# Altium schematic sheet STM32L412CBT6.SchDoc
size A3; SheetNumber: 6; SheetTotal: 9
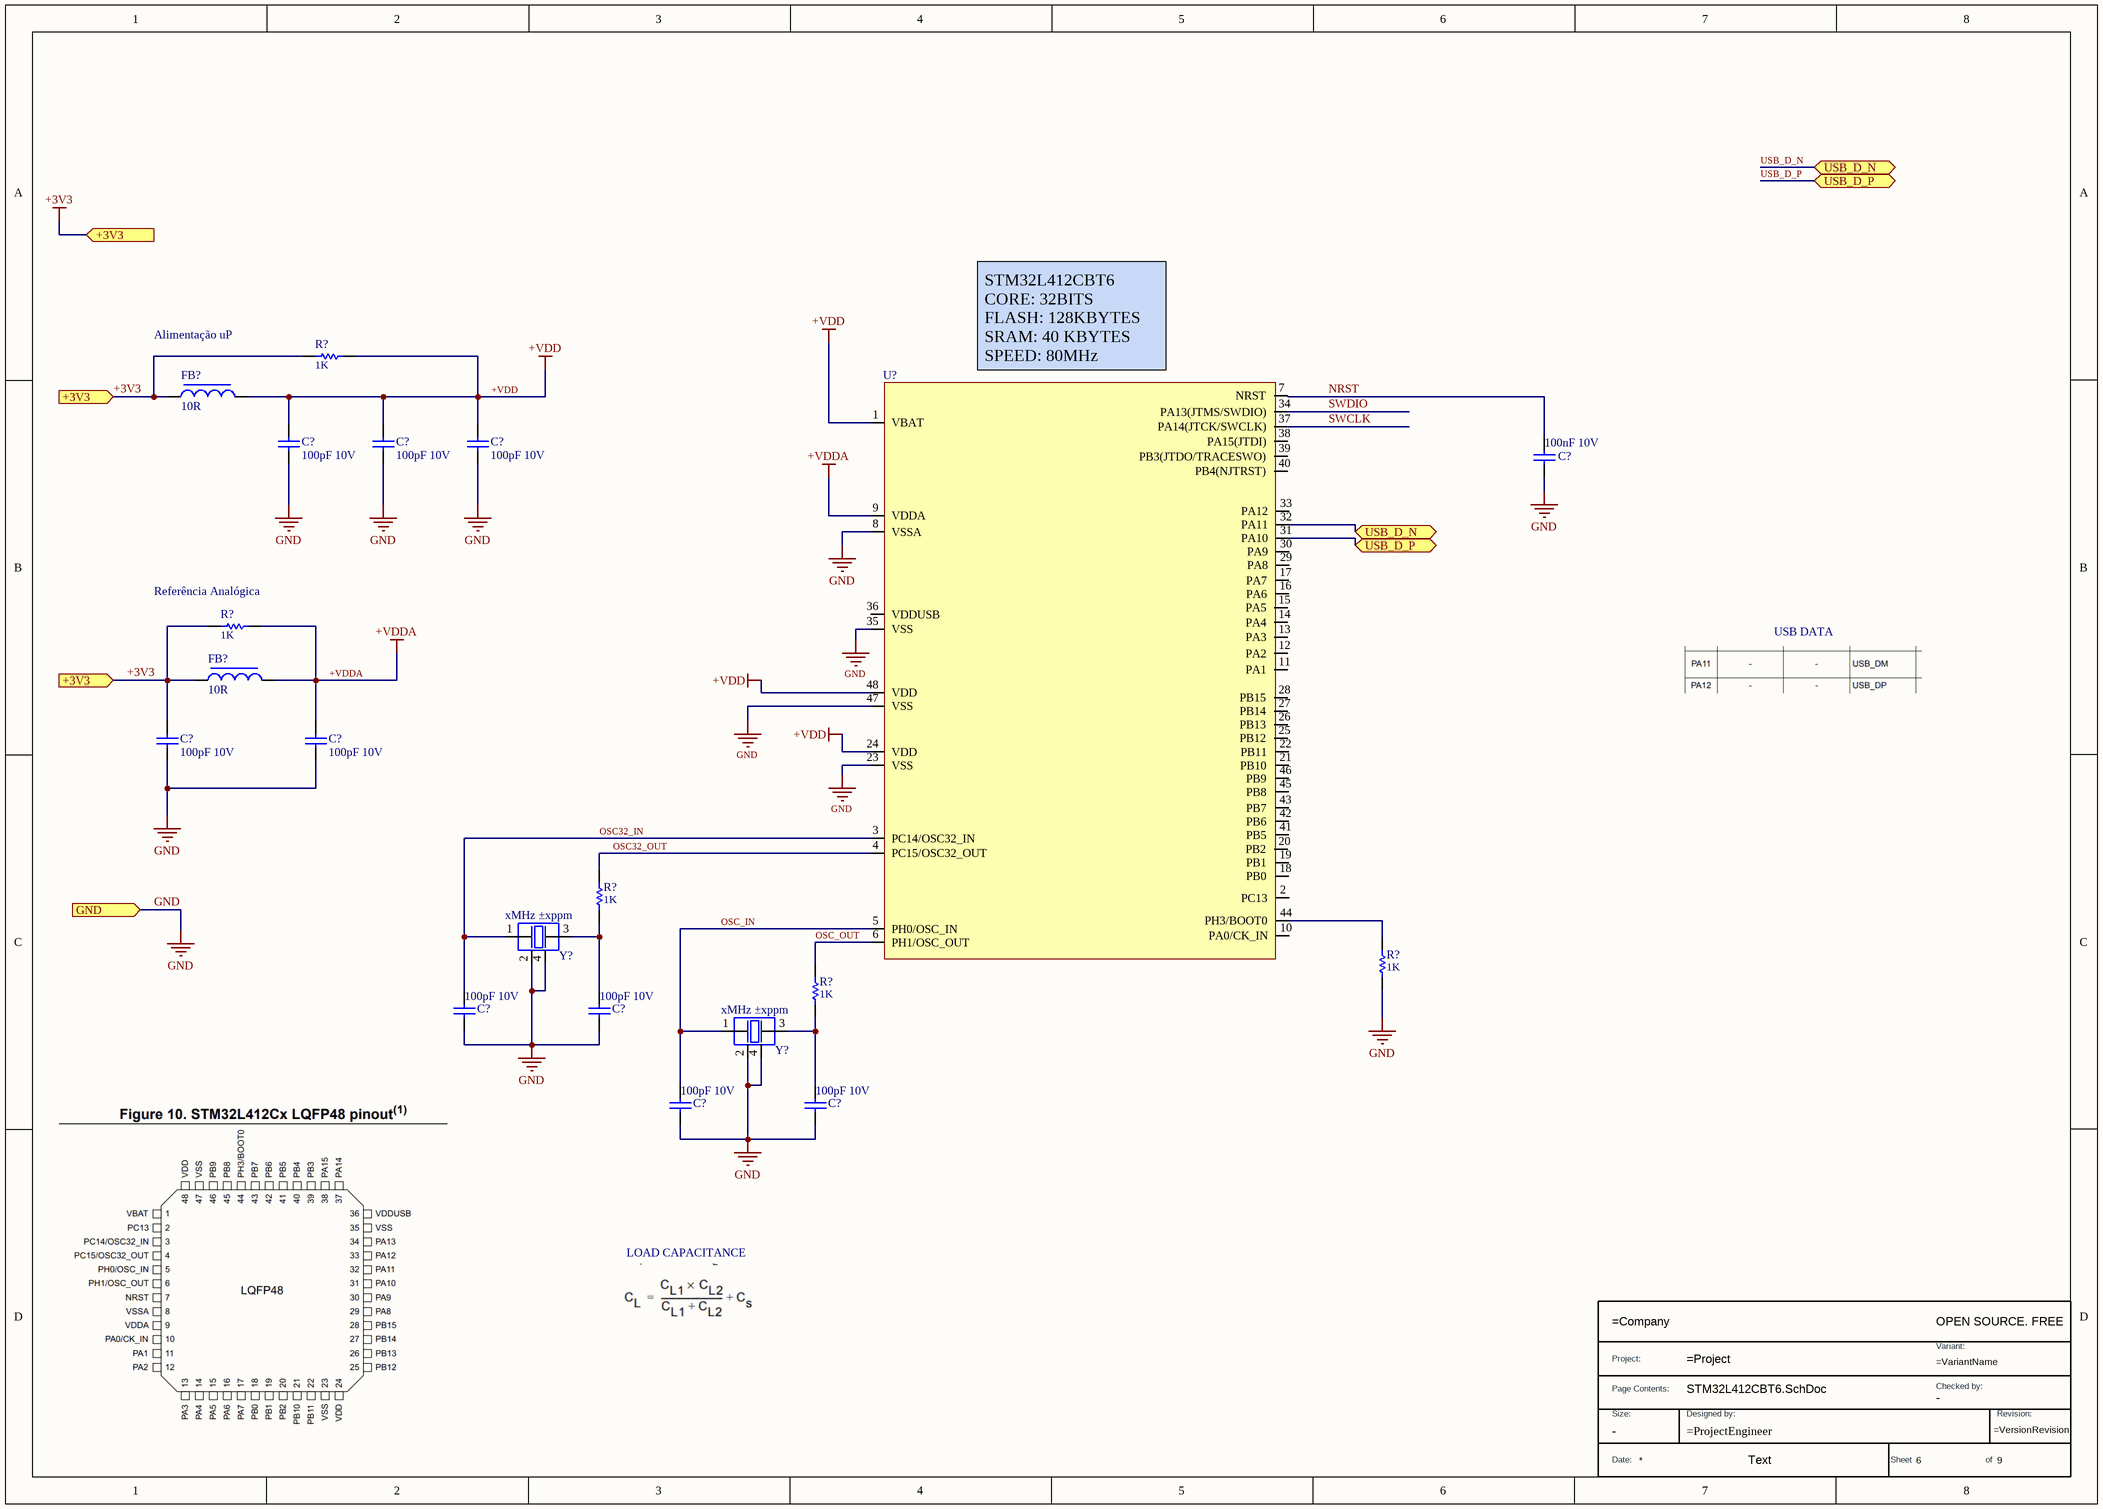
[diagram p0: STM32L412CBT6.SchDoc]

## Parts
(Parts that share a designator on the sheet are numbered #1, #2 ... from top to bottom, then left to right.)
*  TitleBlock  (value not drawn)  (graphical)
C?#1  value 100pF 10V  (hidden comment: _Capacitor)
C?#2  value 100pF 10V  (hidden comment: _Capacitor)
C?#3  value 100pF 10V  (hidden comment: _Capacitor)
C?#4  value 100nF 10V  (hidden comment: _Capacitor)
C?#5  value 100pF 10V  (hidden comment: _Capacitor)
C?#6  value 100pF 10V  (hidden comment: _Capacitor)
C?#7  value 100pF 10V  (hidden comment: _Capacitor)
C?#8  value 100pF 10V  (hidden comment: _Capacitor)
C?#9  value 100pF 10V  (hidden comment: _Capacitor)
C?#10  value 100pF 10V  (hidden comment: _Capacitor)
FB?#1  value 10R  (hidden comment: _FERRITE)
FB?#2  value 10R  (hidden comment: _FERRITE)
R?#1  value 1K  (hidden comment: _Resistor)
R?#2  value 1K  (hidden comment: _Resistor)
R?#3  value 1K  (hidden comment: _Resistor)
R?#4  value 1K  (hidden comment: _Resistor)
R?#5  value 1K  (hidden comment: _Resistor)
U?  STM32L412CBT6  [IC LQFP48]  (value not drawn)
Y?#1  Valor: xMHz ±xppm  (hidden comment: _Crystal)
Y?#2  Valor: xMHz ±xppm  (hidden comment: _Crystal)

## Ports
+3V3 (in, see 1[6B]), GND (in, see 1[3C], 2[4A], 4[1A]), USB_D_N (bidir, see 1[3B]), USB_D_P (bidir, see 1[3B])

## Nets
+3V3: C?#5.2 FB?#1.1 FB?#2.1 R?#1.1 R?#2.1 ; port +3V3
+VDD: C?#1.1 C?#2.1 C?#3.1 FB?#1.2 R?#1.2 U?.1(VBAT) U?.24(VDD) U?.48(VDD)
+VDDA: C?#6.2 FB?#2.2 R?#2.2 U?.9(VDDA)
GND: C?#1.2 C?#2.2 C?#3.2 C?#4.1 C?#5.1 C?#6.1 C?#7.1 C?#8.1 C?#9.1 C?#10.1 R?#4.1 U?.8(VSSA) U?.23(VSS) U?.35(VSS) U?.47(VSS) Y?#1.2 Y?#1.4 Y?#2.2 Y?#2.4 ; port GND
NRST: C?#4.2
OSC32_IN: C?#7.2 U?.3(PC14/OSC32_IN) Y?#1.1
OSC32_OUT: R?#3.2 U?.4(PC15/OSC32_OUT)
OSC_IN: C?#9.2 U?.5(PH0/OSC_IN) Y?#2.1
OSC_OUT: R?#5.2 U?.6(PH1/OSC_OUT)
SWCLK: U?.37(PA14(JTCK/SWCLK))
SWDIO: U?.34(PA13(JTMS/SWDIO))
USB_D_N: U?.32(PA11) ; port USB_D_N
USB_D_P: U?.31(PA10) ; port USB_D_P
NetC?#8_2: C?#8.2 R?#3.1 Y?#1.3
NetC?#10_2: C?#10.2 R?#5.1 Y?#2.3
NetR?#4_2: R?#4.2 U?.44(PH3/BOOT0)

Not connected (* = marked no-connect by the designer): U? 2(PC13) 7(NRST) 10(PA0/CK_IN) 11(PA1) 12(PA2) 13(PA3) 14(PA4) 15(PA5) 16(PA6) 17(PA7) 18(PB0) 19(PB1) 20(PB2) 21(PB10) 22(PB11) 25(PB12) 26(PB13) 27(PB14) 28(PB15) 29(PA8) 30(PA9) 33(PA12) 36(VDDUSB) 38(PA15(JTDI)) 39(PB3(JTDO/TRACESWO)) 40(PB4(NJTRST)) 41(PB5) 42(PB6) 43(PB7) 45(PB8) 46(PB9)

## Notes on the sheet
- Alimentação uP
- (near U?) STM32L412CBT6
  CORE: 32BITS
  FLASH: 128KBYTES
  SRAM: 40 KBYTES
  SPEED: 80MHz
- (near R?#2) Referência Analógica
- USB DATA
- LOAD CAPACITANCE
- Todas as informações e detalhes técnicos deste documento são de inteira propriedade da empresa V2COM,
- não poderão ser copiados, reduzidos ou cedidos a terceiros sem prévia autorização por escrito da mesma.
- Salvo em (D/M/A):
- Página:
- de
- Nome do Projeto:
- https://v2com.com/
- Ed.:
- Responsável:
- Nome da página:
- Rev.:
- Projetista:
- Obs.:
- Revisor:
- Arquivo:
- -
- (in symbol TitleBlock) OPEN SOURCE. FREE; Project:; Variant:; Page Contents:; Checked by:; Size:; Designed by:; Revision:; Date:; Text; Sheet; of

## Library data of the parts
* = TitleBlock: Standard Title Block; DWG NO: =ProjectEngineer; Size: -; Checked by: -
C?#1-C?#10 = _Capacitor: Capacitor; Published: 8-Jun-2000; LatestRevisionDate: 17-Jul-2002; LatestRevisionNote: Re-released for DXP Platform.; PackageReference: RAD-0.3; Publisher: Altium Limited; PackageDescription: Radial Cap, Thru-Hole; 2 Leads; 0.3 in Pin Spacing
FB?#1 FB?#2 = _FERRITE: Ferrite Bead; Code_IEC: 1005; Published: 8-Jun-2000; LatestRevisionDate: 29-May-2009; LatestRevisionNote: IPC-7351 Footprint Added.; PackageReference: 0402-A; Publisher: Altium Limited; PackageDescription: Chip Inductor; Code_JEITA: 0402
R?#1-R?#5 = _Resistor: Resistor; Published: 8-Jun-2000; LatestRevisionDate: 17-Jul-2002; LatestRevisionNote: Re-released for DXP Platform.; PackageReference: AXIAL-0.3; Publisher: Altium Limited; PackageDescription: Axial Device, Thru-Hole; 2 Leads; 0.3 in Pin Spacing
U? = STM32L412CBT6: ARM® Cortex®-M4 STM32L4 Microcontroller IC 32-Bit Single-Core 80MHz 128KB (128K x 8) FLASH 48-LQFP (7x7)
Y?#1 Y?#2 = _Crystal: Crystal; Manufacturer: Diodes Incorporated; Manufacturer Part Number: FL2400022; Origem: MTER_Ed01r1; Case/Package: SMD; Observação: *